# Altium schematic sheet Low_Pass_Filter.SchDoc
size A4; SheetNumber: 2; SheetTotal: 2
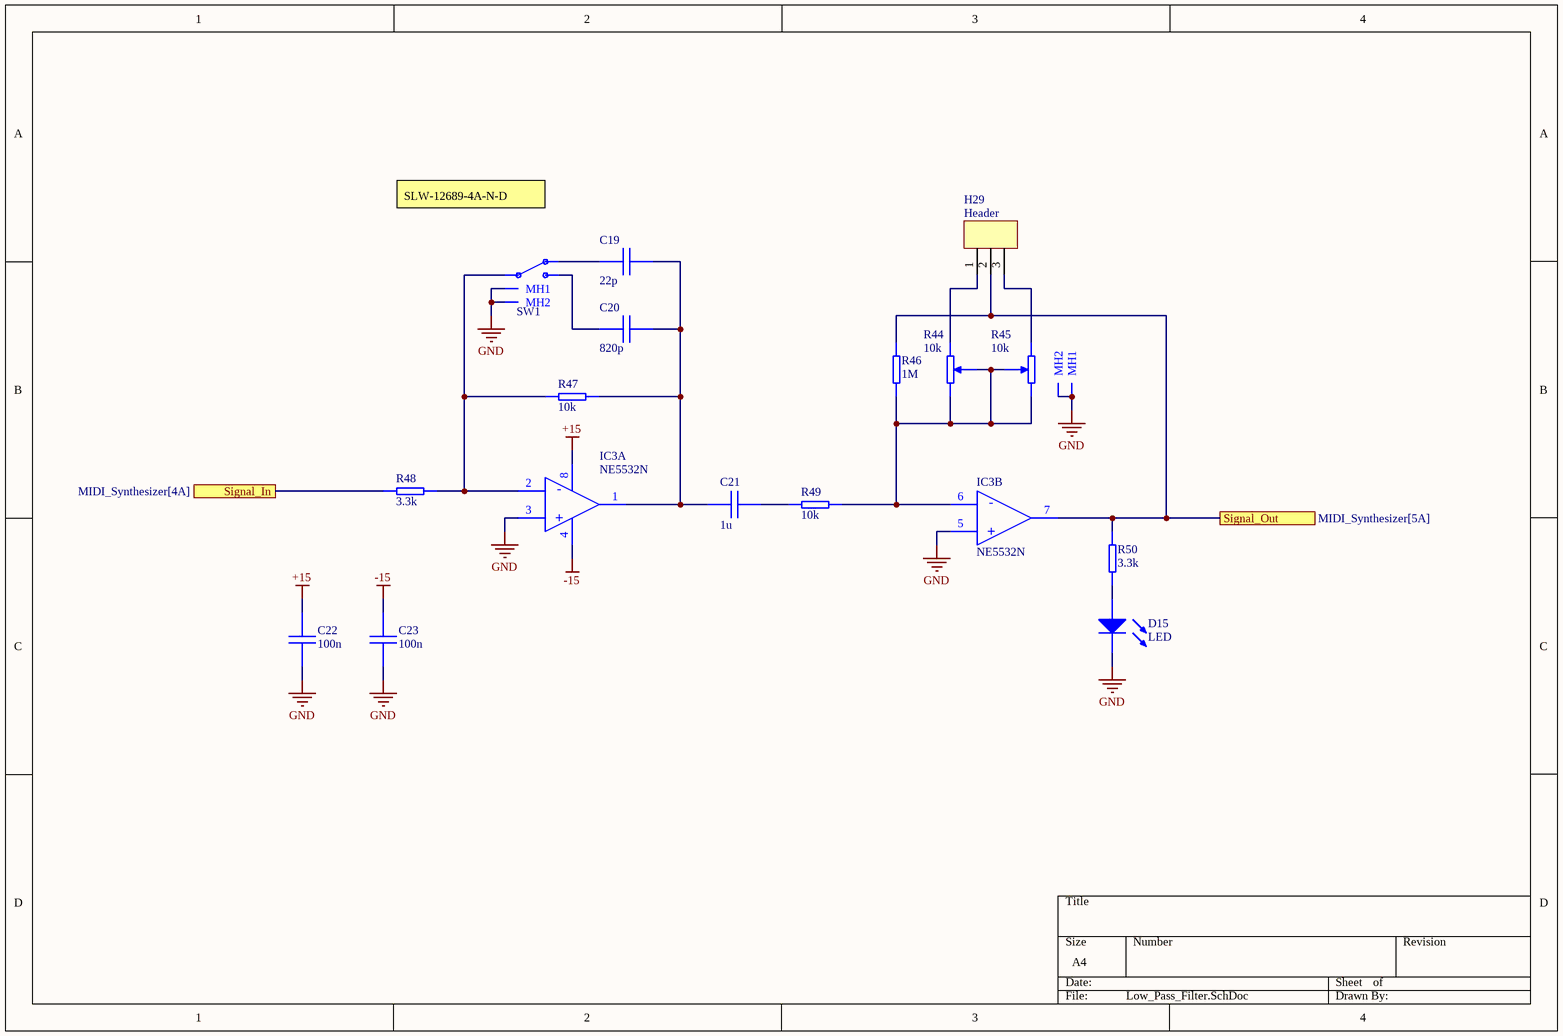
[diagram p0: Low_Pass_Filter.SchDoc]

## Parts
C19  22p  [CAP0603]
C20  820p  [CAP0603]
C21  1u  [CAP0805]
C22  100n  [CAP0805]
C23  100n  [CAP0805]
D15  LED  [LEDM1608X90N]
H29  Header  [Header_1X3]
IC3  NE5532N  [DIP8]  (parts A,B of 2)
R44  10k  [Trim_Pot_Hybrid - No_Silk]
R45  10k  [PTV09A4015FB103]
R46  1M  [RESC0805]
R47  10k  [RESC0805]
R48  3.3k  [RESC0805]
R49  10k  [RESC0805]
R50  3.3k  [RESC0805]
SW1  Slide Switch 4  [SLW126894AND]  (value not drawn)

## Ports
Signal_In (see MIDI_Synthesizer[4A]), Signal_Out (see MIDI_Synthesizer[5A])

## Nets
+15: C22.2 IC3.8(V+)
-15: C23.2 IC3.4(V-)
GND: C22.1 C23.1 D15.1(K) IC3.3(+IN_A) IC3.5(+IN_B) R45.4(MH1) R45.5(MH2) SW1.4(MH1) SW1.5(MH2)
Signal_In: R48.2 ; port Signal_In
Signal_Out: H29.2 IC3.7(OUT_B) R46.1 R50.1 ; port Signal_Out
NetC19_1: C19.1 SW1.1
NetC19_2: C19.2 C20.2 C21.1 IC3.1(OUT_A) R47.1
NetC20_1: C20.1 SW1.3
NetC21_2: C21.2 R49.2
NetD15_2: D15.2(A) R50.2
NetH29_1: H29.1 R44.1
NetH29_3: H29.3 R45.1
NetIC3_2: IC3.2(-IN_A) R47.2 R48.1 SW1.2
NetIC3_6: IC3.6(-IN_B) R44.2 R44.3 R45.2 R45.3 R46.2 R49.1

## Notes on the sheet
- SLW-12689-4A-N-D
- (in symbol NE5532N, part A) -; +
- (in symbol NE5532N, part B) -; +

## Library data of the parts
C19-C23 = Capacitor - Non Polarized: Non Polarized Capacitor
D15 = LED: General Purpose LED; ComponentLink1Description: Datasheet; ComponentLink1URL: https://www.smc-diodes.com/propdf/1N4148W%20N0571%20REV.E.pdf
H29 = 3-Pin Header
IC3 = NE5532N: Integrated Circuit; Manufacturer_Name: onsemi; Datasheet Link: http://www.onsemi.com/pub/Collateral/NE5532-D.PDF; Height: 5.33mm; Manufacturer_Part_Number: NE5532N; Mouser Part Number: 863-NE5532N; Mouser Price/Stock: https://www.mouser.co.uk/ProductDetail/onsemi/NE5532N?qs=8sOby8ZxZLFYqQ84pMQPGQ%3D%3D
R44 = Potentiometer: Potentionmeter
R45 = Potentiometer_Mounted: Potentionmeter
R46-R50 = Resistor
SW1 = Slide Switch 4: Slide Switch